# EasyEDA schematic SCH_ADE-Final_2024-05-14.json
TITLE: ADE-Final-GuitarHero; REV: 1.0; Date: 2024-05-13; Sheet: 1/1; Drawn By: Bennett Russell; Company: Your Company
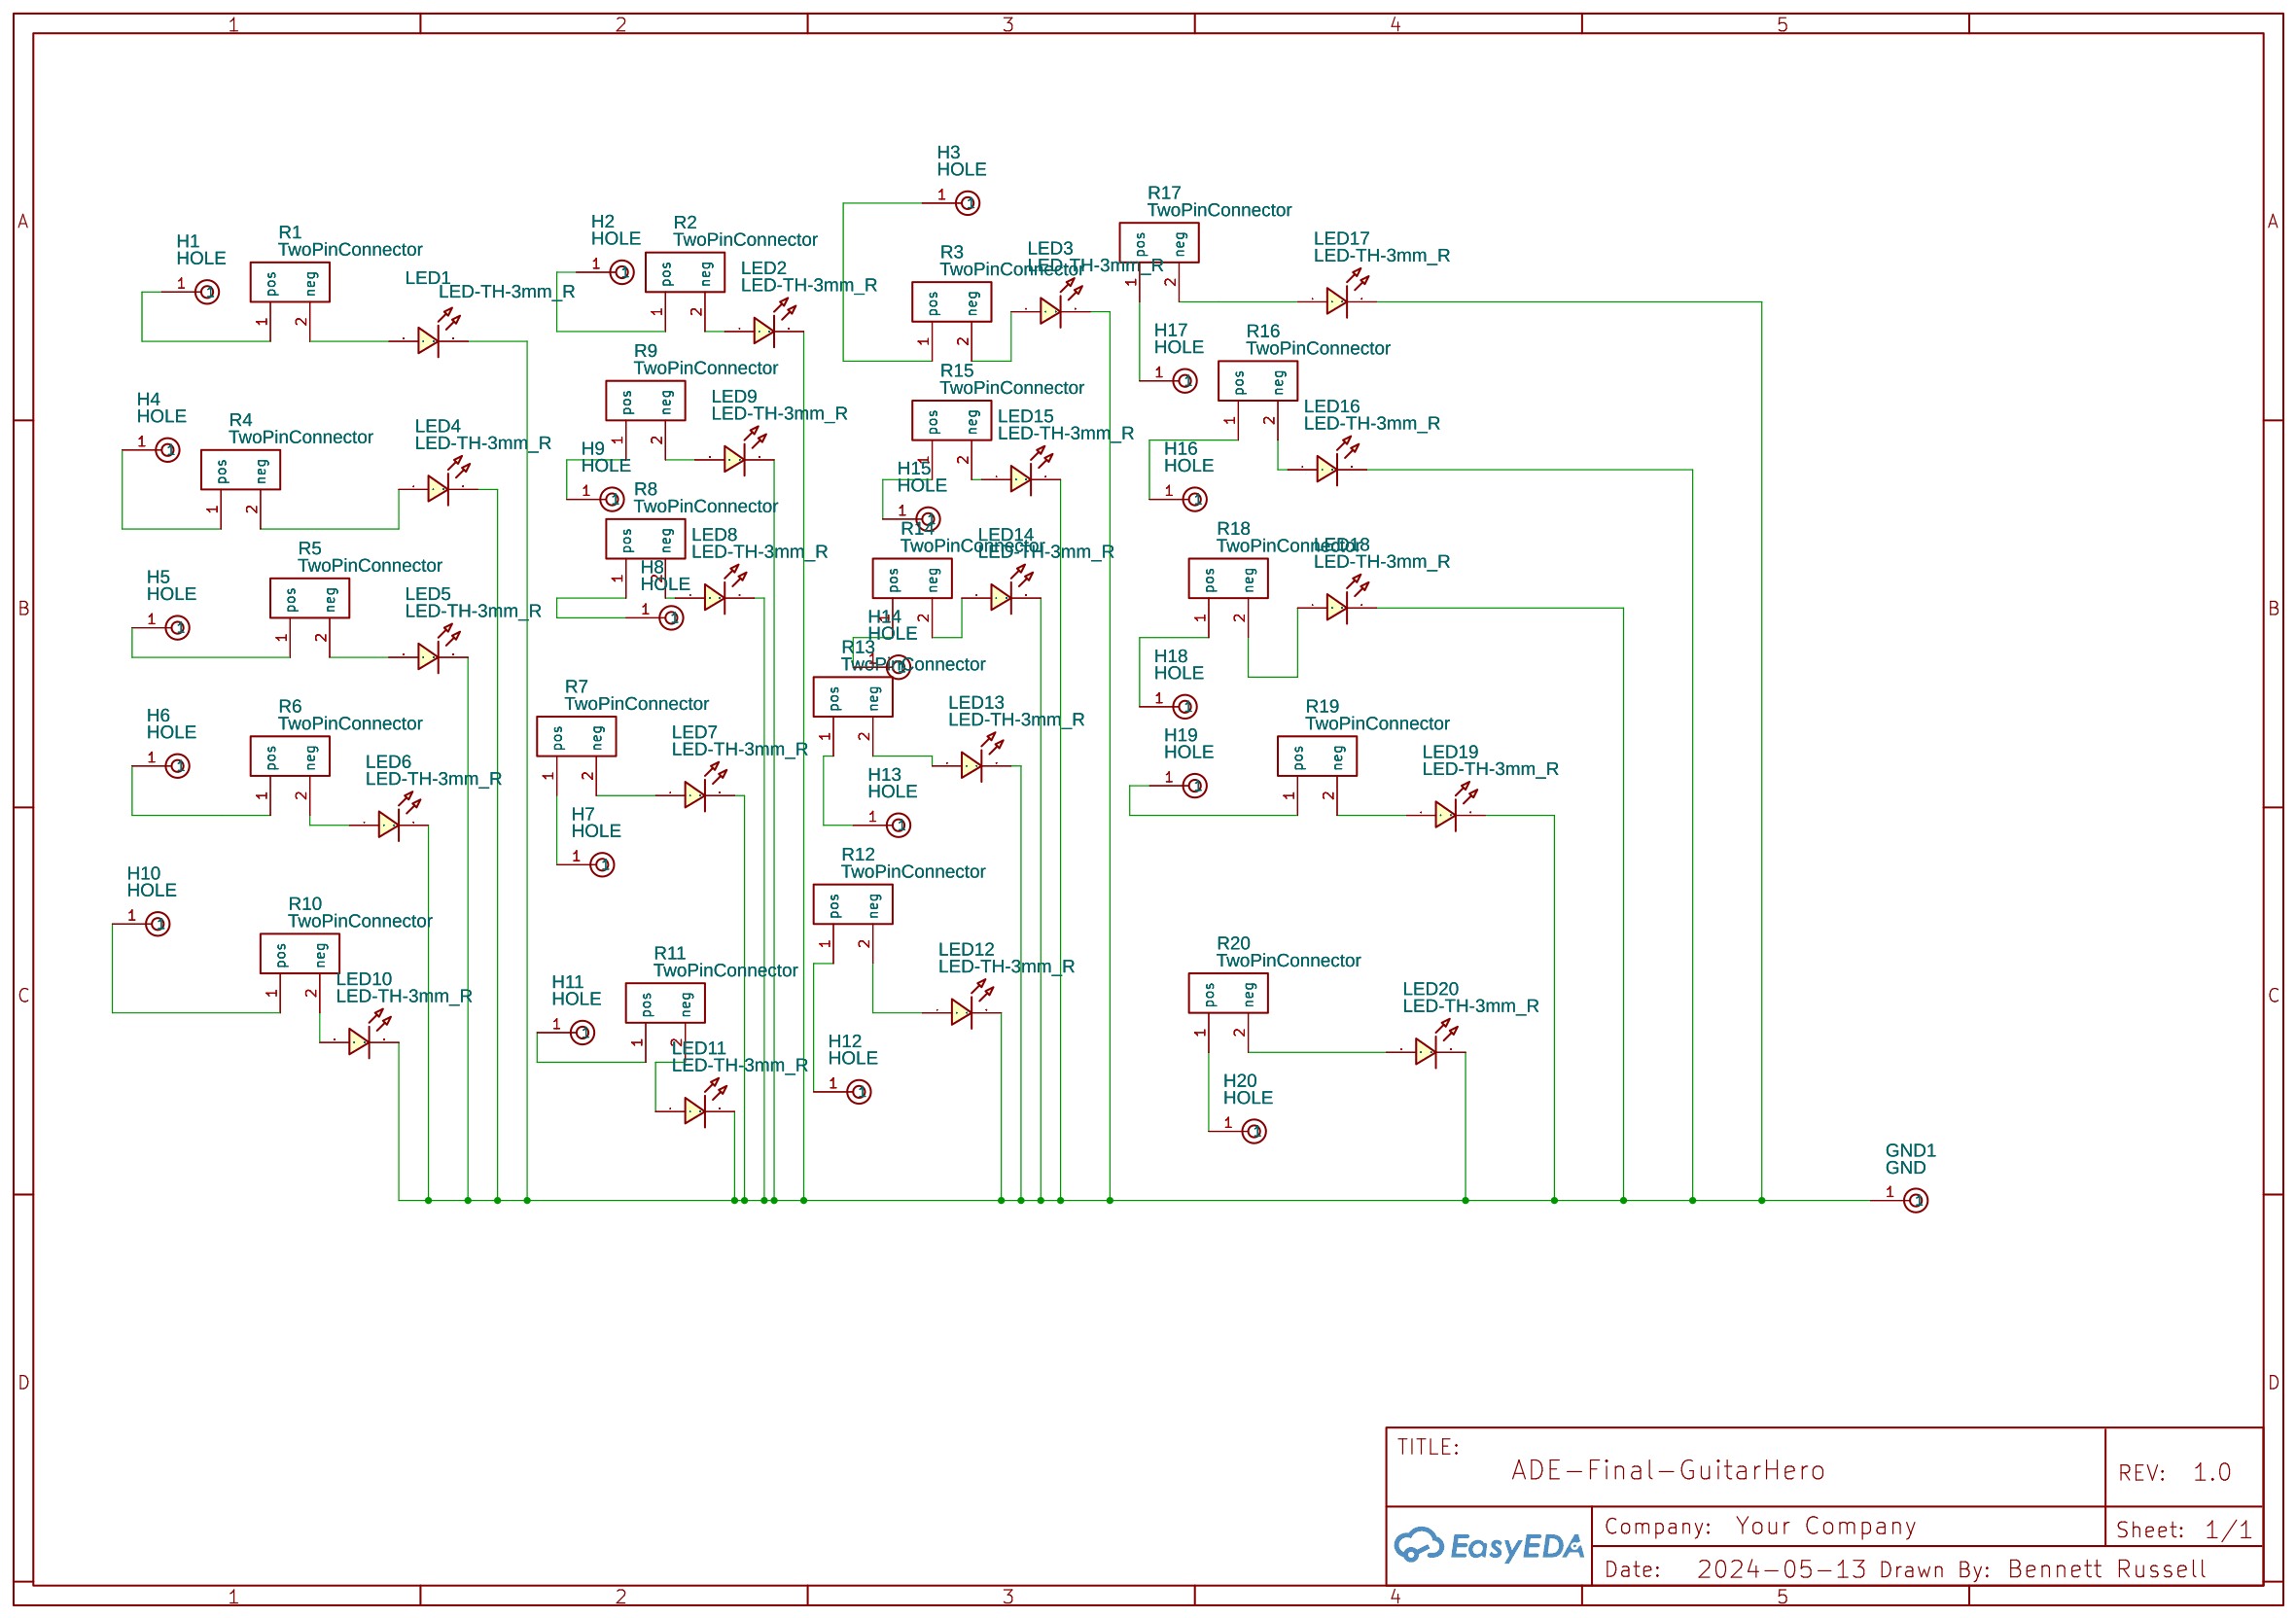
[diagram p0: schematic sheet]

## Parts
GND1  GND  [HOLEHOLE]
H1  HOLE  [HOLEHOLE]
H2  HOLE  [HOLEHOLE]
H3  HOLE  [HOLEHOLE]
H4  HOLE  [HOLEHOLE]
H5  HOLE  [HOLEHOLE]
H6  HOLE  [HOLEHOLE]
H7  HOLE  [HOLEHOLE]
H8  HOLE  [HOLEHOLE]
H9  HOLE  [HOLEHOLE]
H10  HOLE  [HOLEHOLE]
H11  HOLE  [HOLEHOLE]
H12  HOLE  [HOLEHOLE]
H13  HOLE  [HOLEHOLE]
H14  HOLE  [HOLEHOLE]
H15  HOLE  [HOLEHOLE]
H16  HOLE  [HOLEHOLE]
H17  HOLE  [HOLEHOLE]
H18  HOLE  [HOLEHOLE]
H19  HOLE  [HOLEHOLE]
H20  HOLE  [HOLEHOLE]
LED1  LED-TH-3mm_R  [LED-TH_BD3.0_RED]
LED2  LED-TH-3mm_R  [LED-TH_BD3.0_RED]
LED3  LED-TH-3mm_R  [LED-TH_BD3.0_RED]
LED4  LED-TH-3mm_R  [LED-TH_BD3.0_RED]
LED5  LED-TH-3mm_R  [LED-TH_BD3.0_RED]
LED6  LED-TH-3mm_R  [LED-TH_BD3.0_RED]
LED7  LED-TH-3mm_R  [LED-TH_BD3.0_RED]
LED8  LED-TH-3mm_R  [LED-TH_BD3.0_RED]
LED9  LED-TH-3mm_R  [LED-TH_BD3.0_RED]
LED10  LED-TH-3mm_R  [LED-TH_BD3.0_RED]
LED11  LED-TH-3mm_R  [LED-TH_BD3.0_RED]
LED12  LED-TH-3mm_R  [LED-TH_BD3.0_RED]
LED13  LED-TH-3mm_R  [LED-TH_BD3.0_RED]
LED14  LED-TH-3mm_R  [LED-TH_BD3.0_RED]
LED15  LED-TH-3mm_R  [LED-TH_BD3.0_RED]
LED16  LED-TH-3mm_R  [LED-TH_BD3.0_RED]
LED17  LED-TH-3mm_R  [LED-TH_BD3.0_RED]
LED18  LED-TH-3mm_R  [LED-TH_BD3.0_RED]
LED19  LED-TH-3mm_R  [LED-TH_BD3.0_RED]
LED20  LED-TH-3mm_R  [LED-TH_BD3.0_RED]
R1  TwoPinConnector  [TWOPINCONNECTOR]
R2  TwoPinConnector  [TWOPINCONNECTOR]
R3  TwoPinConnector  [TWOPINCONNECTOR]
R4  TwoPinConnector  [TWOPINCONNECTOR]
R5  TwoPinConnector  [TWOPINCONNECTOR]
R6  TwoPinConnector  [TWOPINCONNECTOR]
R7  TwoPinConnector  [TWOPINCONNECTOR]
R8  TwoPinConnector  [TWOPINCONNECTOR]
R9  TwoPinConnector  [TWOPINCONNECTOR]
R10  TwoPinConnector  [TWOPINCONNECTOR]
R11  TwoPinConnector  [TWOPINCONNECTOR]
R12  TwoPinConnector  [TWOPINCONNECTOR]
R13  TwoPinConnector  [TWOPINCONNECTOR]
R14  TwoPinConnector  [TWOPINCONNECTOR]
R15  TwoPinConnector  [TWOPINCONNECTOR]
R16  TwoPinConnector  [TWOPINCONNECTOR]
R17  TwoPinConnector  [TWOPINCONNECTOR]
R18  TwoPinConnector  [TWOPINCONNECTOR]
R19  TwoPinConnector  [TWOPINCONNECTOR]
R20  TwoPinConnector  [TWOPINCONNECTOR]

## Library data of the parts
GND1 H1-H20 = HOLE: Contributor: tycheen
LED1-LED20 = LED-TH-3mm_R: Manufacturer: EVERLIGHT(台湾亿光); Manufacturer Part: 204-10SDRD/S530-A3-L; Supplier Part: C84774; Supplier: LCSC; Contributor: LCEDA_Lib
R1-R20 = TwoPinConnector: Contributor: Muneeb Rehman

## Nets
Net-(GND1-1): GND1.1 LED1.2 LED2.2 LED3.2 LED4.2 LED5.2 LED6.2 LED7.2 LED8.2 LED9.2 LED10.2 LED11.2 LED12.2 LED13.2 LED14.2 LED15.2 LED16.2 LED17.2 LED18.2 LED19.2 LED20.2
Net-(H1-1): H1.1 R1.1(pos)
Net-(H2-1): H2.1 R2.1(pos)
Net-(H3-1): H3.1 R3.1(pos)
Net-(H4-1): H4.1 R4.1(pos)
Net-(H5-1): H5.1 R5.1(pos)
Net-(H6-1): H6.1 R6.1(pos)
Net-(H7-1): H7.1 R7.1(pos)
Net-(H8-1): H8.1 R8.1(pos)
Net-(H9-1): H9.1 R9.1(pos)
Net-(H10-1): H10.1 R10.1(pos)
Net-(H11-1): H11.1 R11.1(pos)
Net-(H12-1): H12.1 R12.1(pos)
Net-(H13-1): H13.1 R13.1(pos)
Net-(H14-1): H14.1 R14.1(pos)
Net-(H15-1): H15.1 R15.1(pos)
Net-(H16-1): H16.1 R16.1(pos)
Net-(H17-1): H17.1 R17.1(pos)
Net-(H18-1): H18.1 R18.1(pos)
Net-(H19-1): H19.1 R19.1(pos)
Net-(H20-1): H20.1 R20.1(pos)
Net-(LED1-1): LED1.1 R1.2(neg)
Net-(LED2-1): LED2.1 R2.2(neg)
Net-(LED3-1): LED3.1 R3.2(neg)
Net-(LED4-1): LED4.1 R4.2(neg)
Net-(LED5-1): LED5.1 R5.2(neg)
Net-(LED6-1): LED6.1 R6.2(neg)
Net-(LED7-1): LED7.1 R7.2(neg)
Net-(LED8-1): LED8.1 R8.2(neg)
Net-(LED9-1): LED9.1 R9.2(neg)
Net-(LED10-1): LED10.1 R10.2(neg)
Net-(LED11-1): LED11.1 R11.2(neg)
Net-(LED12-1): LED12.1 R12.2(neg)
Net-(LED13-1): LED13.1 R13.2(neg)
Net-(LED14-1): LED14.1 R14.2(neg)
Net-(LED15-1): LED15.1 R15.2(neg)
Net-(LED16-1): LED16.1 R16.2(neg)
Net-(LED17-1): LED17.1 R17.2(neg)
Net-(LED18-1): LED18.1 R18.2(neg)
Net-(LED19-1): LED19.1 R19.2(neg)
Net-(LED20-1): LED20.1 R20.2(neg)
